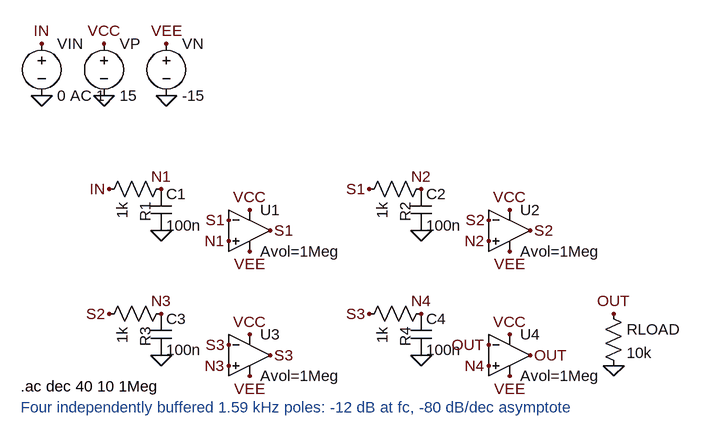
[diagram p0: schematic 16_active_fourth_order_filter.asc]
16_active_fourth_order_filter.asc, the LTspice schematic file:
Version 4
SHEET 1 1120 760
FLAG 80 96 IN
FLAG 80 176 0
FLAG 176 96 VCC
FLAG 176 176 0
FLAG 272 96 VEE
FLAG 272 176 0
FLAG 184 320 IN
FLAG 264 320 N1
FLAG 264 384 0
FLAG 368 400 N1
FLAG 368 368 S1
FLAG 432 384 S1
FLAG 400 352 VCC
FLAG 400 416 VEE
FLAG 584 320 S1
FLAG 664 320 N2
FLAG 664 384 0
FLAG 768 400 N2
FLAG 768 368 S2
FLAG 832 384 S2
FLAG 800 352 VCC
FLAG 800 416 VEE
FLAG 184 512 S2
FLAG 264 512 N3
FLAG 264 576 0
FLAG 368 592 N3
FLAG 368 560 S3
FLAG 432 576 S3
FLAG 400 544 VCC
FLAG 400 608 VEE
FLAG 584 512 S3
FLAG 664 512 N4
FLAG 664 576 0
FLAG 768 592 N4
FLAG 768 560 OUT
FLAG 832 576 OUT
FLAG 800 544 VCC
FLAG 800 608 VEE
FLAG 960 512 OUT
FLAG 960 592 0
SYMBOL voltage 80 80 R0
SYMATTR InstName VIN
SYMATTR Value 0 AC 1
SYMBOL voltage 176 80 R0
SYMATTR InstName VP
SYMATTR Value 15
SYMBOL voltage 272 80 R0
SYMATTR InstName VN
SYMATTR Value -15
SYMBOL res 280 304 R90
SYMATTR InstName R1
SYMATTR Value 1k
SYMBOL cap 248 320 R0
SYMATTR InstName C1
SYMATTR Value 100n
SYMBOL opamp2 400 320 R0
SYMATTR InstName U1
SYMATTR Value Avol=1Meg
SYMBOL res 680 304 R90
SYMATTR InstName R2
SYMATTR Value 1k
SYMBOL cap 648 320 R0
SYMATTR InstName C2
SYMATTR Value 100n
SYMBOL opamp2 800 320 R0
SYMATTR InstName U2
SYMATTR Value Avol=1Meg
SYMBOL res 280 496 R90
SYMATTR InstName R3
SYMATTR Value 1k
SYMBOL cap 248 512 R0
SYMATTR InstName C3
SYMATTR Value 100n
SYMBOL opamp2 400 512 R0
SYMATTR InstName U3
SYMATTR Value Avol=1Meg
SYMBOL res 680 496 R90
SYMATTR InstName R4
SYMATTR Value 1k
SYMBOL cap 648 512 R0
SYMATTR InstName C4
SYMATTR Value 100n
SYMBOL opamp2 800 512 R0
SYMATTR InstName U4
SYMATTR Value Avol=1Meg
SYMBOL res 944 496 R0
SYMATTR InstName RLOAD
SYMATTR Value 10k
TEXT 48 624 Left 2 !.ac dec 40 10 1Meg
TEXT 48 656 Left 2 ;Four independently buffered 1.59 kHz poles: -12 dB at fc, -80 dB/dec asymptote

The netlist it stands for:
* 16_active_fourth_order_filter.asc
VIN IN 0 0 AC 1
VP VCC 0 15
VN VEE 0 -15
R1 N1 IN 1k
C1 N1 0 100n
XU1 N1 S1 VCC VEE S1 Avol=1Meg  ; pins In+ In- V+ V- OUT
R2 N2 S1 1k
C2 N2 0 100n
XU2 N2 S2 VCC VEE S2 Avol=1Meg  ; pins In+ In- V+ V- OUT
R3 N3 S2 1k
C3 N3 0 100n
XU3 N3 S3 VCC VEE S3 Avol=1Meg  ; pins In+ In- V+ V- OUT
R4 N4 S3 1k
C4 N4 0 100n
XU4 N4 OUT VCC VEE OUT Avol=1Meg  ; pins In+ In- V+ V- OUT
RLOAD OUT 0 10k
.ac dec 40 10 1Meg
* Four independently buffered 1.59 kHz poles: -12 dB at fc, -80 dB/dec asymptote
.backanno
.end